# EAGLE schematic Lab 6 C (EAGLE 9.6.2)
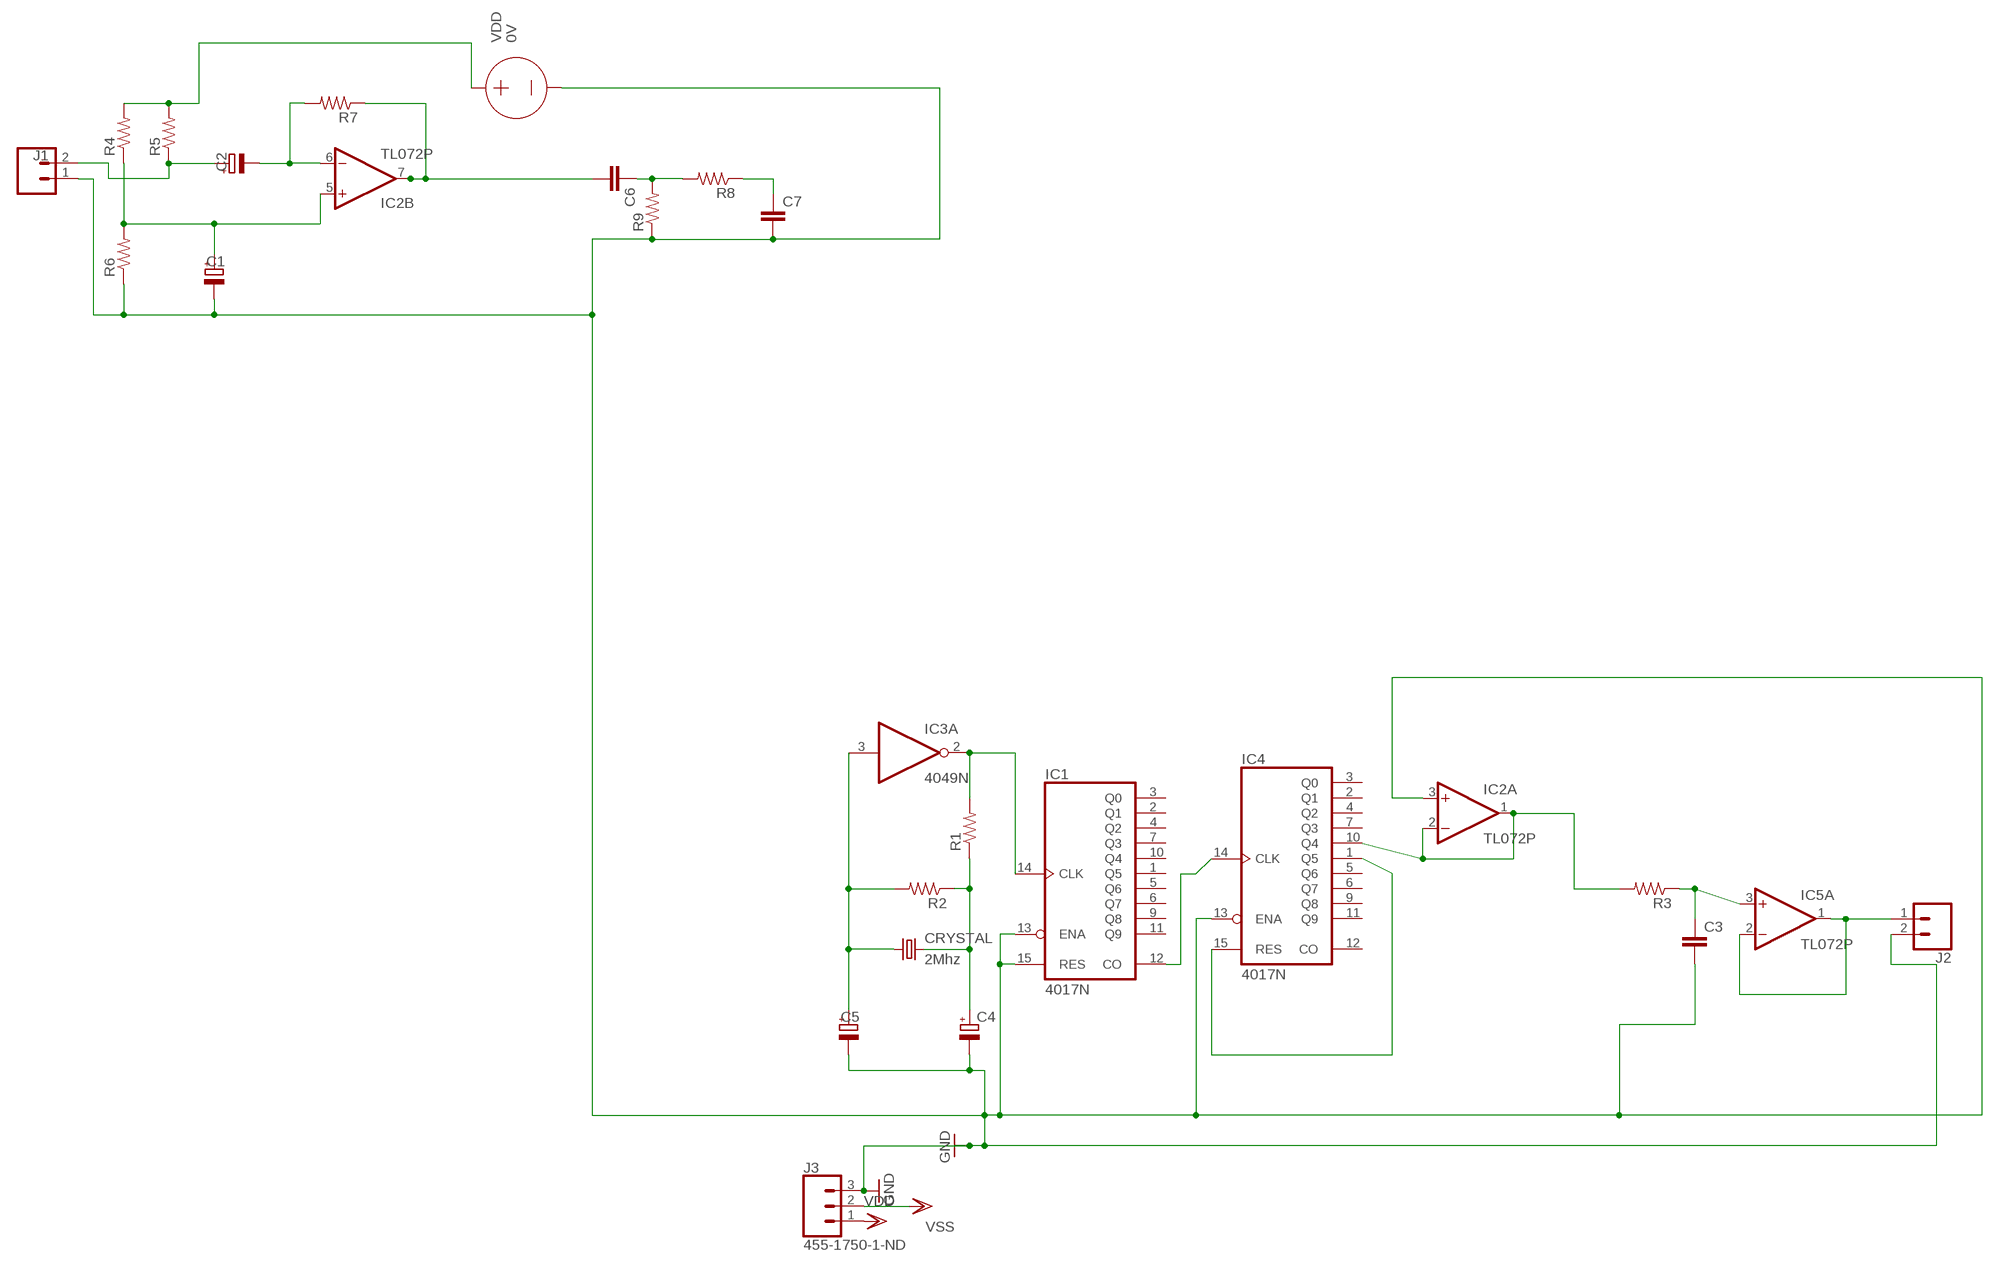
[diagram p0: schematic, sheet 1]

## Parts
C1  CPOL-EUB45181A  [B45181A]
C2  CPOL-EUB45181A  [B45181A]
C3  C-EU050-025X075  [C050-025X075]
C4  CPOL-EUB45181A  [B45181A]
C5  CPOL-EUB45181A  [B45181A]
C6  C-EU050-025X075  [C050-025X075]
C7  C-EU050-025X075  [C050-025X075]
CRYSTAL  2Mhz  CRYSTALHC49U-V  [HC49U-V]
IC1  4017N  [DIL16]
IC2  TL072P  [DIL08]
IC3  4049N  [DIL16]
IC4  4017N  [DIL16]
IC5  TL072P  [DIL08]
J1  CONN_02  [1X02]
J2  CONN_02  [1X02]
J3  455-1750-1-ND  CONN_03  [1X03]
R1  R-US_0411/15  [0411/15]
R2  R-US_0411/15  [0411/15]
R3  R-US_0411/15  [0411/15]
R4  R-US_0411/15  [0411/15]
R5  R-US_0411/15  [0411/15]
R6  R-US_0411/15  [0411/15]
R7  R-US_0411/15  [0411/15]
R8  R-US_0411/15  [0411/15]
R9  R-US_0411/15  [0411/15]
VDD  0V  VOLTAGE  (no package)

## Nets
GND: C1.- C3.2 C4.- C5.- C7.2 IC1.13(ENA) IC1.15(RES) IC2.3(A:+IN) IC4.13(ENA) J1.1 J2.2 J3.3 R6.1 R9.1 VDD.-
N$1: IC1.14(CLK) IC3.2(A:O) R1.2
N$2: IC1.12(CO) IC4.14(CLK)
N$3: IC4.1(Q5) IC4.15(RES)
N$4: C4.+ CRYSTAL.2 R1.1 R2.1
N$5: C5.+ CRYSTAL.1 IC3.3(A:I) R2.2
N$6: IC2.1(A:OUT) IC2.2(A:-IN) IC4.10(Q4) R3.2
N$7: C3.1 IC5.3(A:+IN) R3.1
N$8: IC5.1(A:OUT) IC5.2(A:-IN) J2.1
N$10: C6.2 IC2.7(B:OUT) R7.1
N$11: R4.2 R5.2 VDD.+
N$12: C2.- IC2.6(B:-IN) R7.2
N$13: C6.1 R8.2 R9.2
N$14: C2.+ J1.2 R5.1
N$16: C7.1 R8.1
N$17: C1.+ IC2.5(B:+IN) R4.1 R6.2
VDD: J3.1
VSS: J3.2
Unconnected: IC1.1(Q5) IC1.2(Q1) IC1.3(Q0) IC1.4(Q2) IC1.5(Q6) IC1.6(Q7) IC1.7(Q3) IC1.9(Q8) IC1.10(Q4) IC1.11(Q9) IC3.4(B:O) IC3.5(B:I) IC3.6(C:O) IC3.7(C:I) IC3.9(D:I) IC3.10(D:O) IC3.11(E:I) IC3.12(E:O) IC3.14(F:I) IC3.15(F:O) IC4.2(Q1) IC4.3(Q0) IC4.4(Q2) IC4.5(Q6) IC4.6(Q7) IC4.7(Q3) IC4.9(Q8) IC4.11(Q9) IC4.12(CO) IC5.5(B:+IN) IC5.6(B:-IN) IC5.7(B:OUT)

## Power pins joined to a net without a drawn wire
V+: IC2.8(P:V+) IC5.8(P:V+)
V-: IC2.4(P:V-) IC5.4(P:V-)
VDD: IC1.16(VDD) IC3.1(P:VDD) IC4.16(VDD)
VSS: IC1.8(VSS) IC3.8(P:VSS) IC4.8(VSS)

## Library data of the parts
C1 C2 C4 C5 = rcl:CPOL-EU: POLARIZED CAPACITOR, European symbol; SPICEPREFIX: C
C3 C6 C7 = rcl:C-EU: CAPACITOR, European symbol; SPICEPREFIX: C
CRYSTAL = crystal:CRYSTAL: CRYSTAL; OC_FARNELL: 1666969; OC_NEWARK: unknown
IC1 IC4 = 40xx:4017: COUNTER/DIVIDER
IC2 IC5 = linear:TL072: OP AMP
IC3 = 40xx:4049: Hex inverting BUFFER
J1 J2 = SparkFun-Connectors:CONN_02: Multi connection point. Often used as Generic Header-pin footprint for 0.1 inch spaced/style header connections On any of the 0.1 inch spaced packages, you can populate with these: Break Away Headers - Straight <https://www.sparkfun.com/products/116> (PRT-00116) Break Away Male Headers - Right Angle <https://www.sparkfun.com/products/553> (PRT-00553) Female Headers <https://www.sparkfun.com/products/115> (PRT-00115) Break Away Headers - Machine Pin <https://www.sparkfun.com/products/117> (PRT-00117) Break Away Female Headers - Swiss Machine Pin <https://www.sparkfun.com/products/743> (PRT-00743) For SCREWTERMINALS and SPRING TERMINALS visit here: Screw Terimnals on SparkFun.com <https://www.sparkfun.com/search/results?term=Screw+Terminals> (5mm/3.5mm/2.54mm spacing) This device is also useful as a general connection point to wire up your design to another part of your project. Our various solder wires solder well into these plated through hole pads. Hook-Up Wire - Assortment (Stranded, 22 AWG) <https://www.sparkfun.com/products/11375> (PRT-11375) Hook-Up Wire - Assortment (Solid Core, 22 AWG) <https://www.sparkfun.com/products/11367> (PRT-11367) View the entire wire category on our website here <https://www.sparkfun.com/categories/141> Special notes: Molex polarized connector foot print use with: PRT-08233 with associated crimp pins and housings. 2.54_SCREWTERM for use with PRT-10571. 3.5mm Screw Terminal footprints for PRT-08084 5mm Screw Terminal footprints for use with PRT-08432
J3 = SparkFun-Connectors:CONN_03: Multi connection point. Often used as Generic Header-pin footprint for 0.1 inch spaced/style header connections On any of the 0.1 inch spaced packages, you can populate with these: Break Away Headers - Straight <https://www.sparkfun.com/products/116> (PRT-00116) Break Away Male Headers - Right Angle <https://www.sparkfun.com/products/553> (PRT-00553) Female Headers <https://www.sparkfun.com/products/115> (PRT-00115) Break Away Headers - Machine Pin <https://www.sparkfun.com/products/117> (PRT-00117) Break Away Female Headers - Swiss Machine Pin <https://www.sparkfun.com/products/743> (PRT-00743) Stackable Header - 3 Pin (Female, 0.1") <https://www.sparkfun.com/products/13875> (PRT-13875) For SCREWTERMINALS and SPRING TERMINALS visit here: Screw Terimnals on SparkFun.com <https://www.sparkfun.com/search/results?term=Screw+Terminals> (5mm/3.5mm/2.54mm spacing) This device is also useful as a general connection point to wire up your design to another part of your project. Our various solder wires solder well into these plated through hole pads. Hook-Up Wire - Assortment (Stranded, 22 AWG) <https://www.sparkfun.com/products/11375> (PRT-11375) Hook-Up Wire - Assortment (Solid Core, 22 AWG) <https://www.sparkfun.com/products/11367> (PRT-11367) View the entire wire category on our website here <https://www.sparkfun.com/categories/141> Special notes: Molex polarized connector foot print use with SKU : PRT-08232 with associated crimp pins and housings.; PROD_ID: XXX-00000
R1-R9 = resistor:R-US_: RESISTOR, American symbol
VDD = ngspice-simulation:VOLTAGE: Independent Voltage Source, either DC, AC, PULSE, SINE, PWL, EXP, or SFFM